# Altium schematic sheet [1]PowerSupply.SchDoc
size A4; SheetNumber: 1; SheetTotal: 3
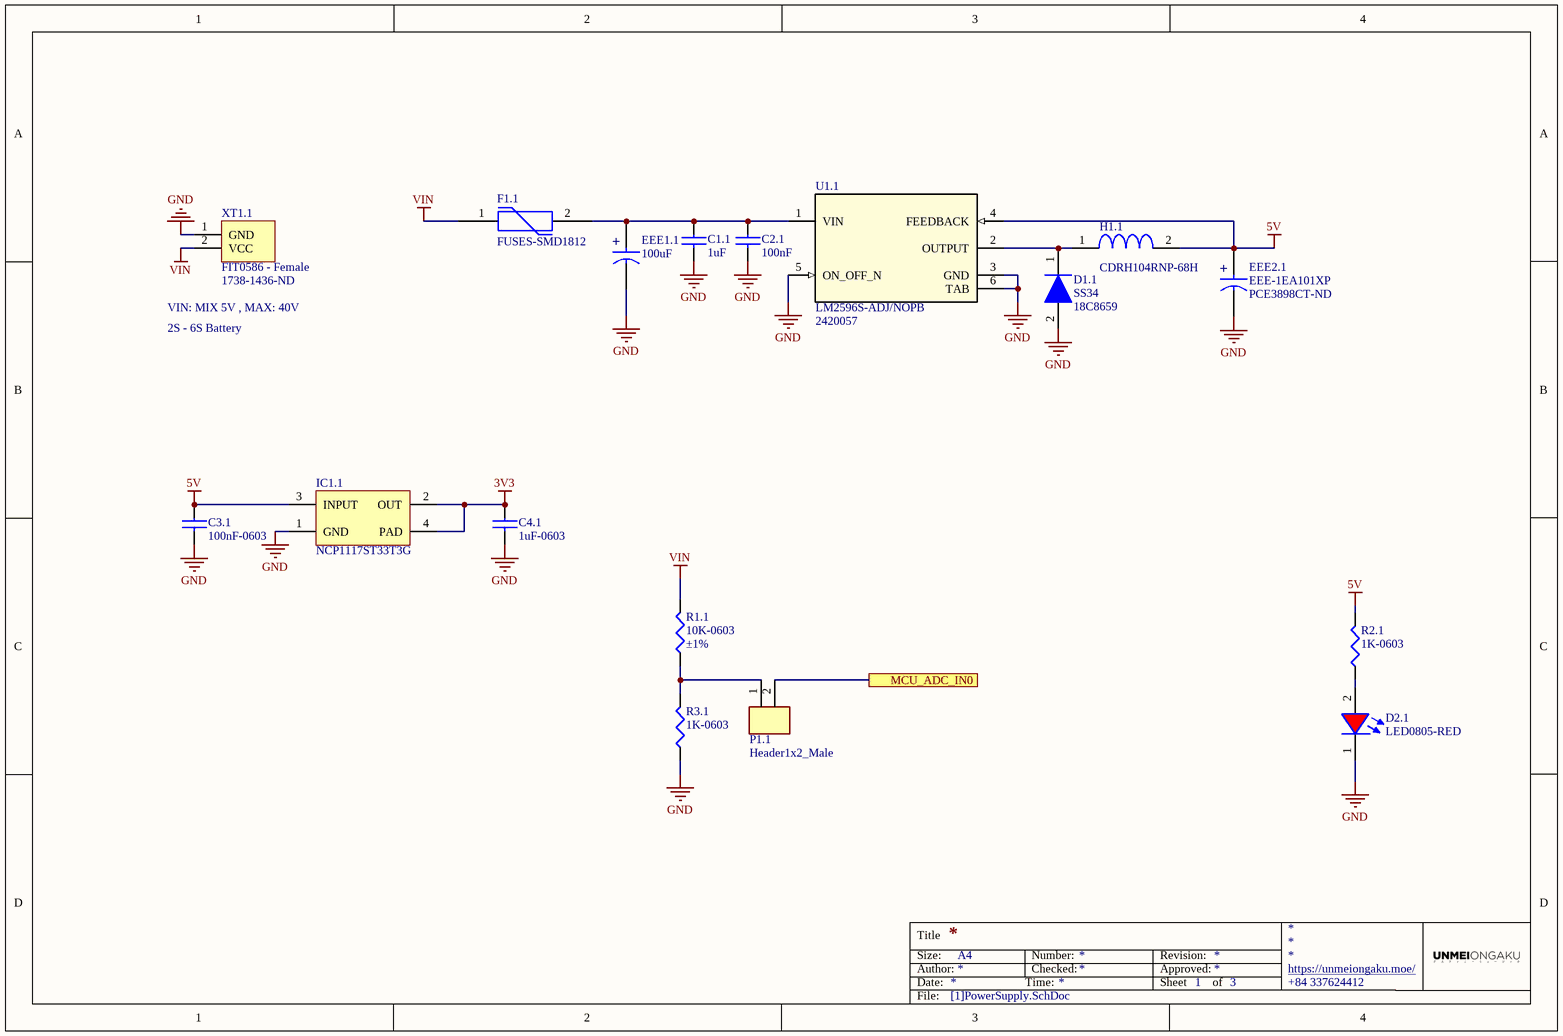
[diagram p0: [1]PowerSupply.SchDoc]

## Parts
C1.1  1uF  [CAP0603]
C2.1  100nF  [CAP0603]
C3.1  100nF-0603  [CAP0603]
C4.1  1uF-0603  [CAP0603]
D1.1  SS34  Supplier Part Number 1: 18C8659  [SS34 - 1N5822 / DO-214AA, SMA]
D2.1  LED0805-RED  [LED0805-RED]
EEE1.1  100uF  [CAPACITOR/ALU - SIZE D/SMD - 6.3X5.4]
EEE2.1  EEE-1EA101XP  Supplier Part Number 1: PCE3898CT-ND  [CAPACITOR/ALU - SIZE D8/SMD - 6.3X7.7]
F1.1  FUSES-SMD1812  [FUSES - SMD1812]
H1.1  CDRH104RNP-68H  [CDRH104RNP]
IC1.1  NCP1117ST33T3G  [SOT223-4M_AMS1117_3V3]
P1.1  Header1x2_Male  [HDR1x2_2.54_MALE]
R1.1  10K-0603  Tolerance: ±1%  [RES0603 - 3D]
R2.1  1K-0603  [RES0603 - 3D]
R3.1  1K-0603  [RES0603 - 3D]
U1.1  LM2596S-ADJ/NOPB  Supplier Part Number 1: 2420057  [TO265-5]
XT1.1  FIT0586 - Female  Supplier Part Number 1: 1738-1436-ND  [XT30U-M]

## Ports
MCU_ADC_IN0

## Nets
3V3: C4.1.1 IC1.1.2(OUT) IC1.1.4(PAD)
5V: C3.1.1 EEE2.1.1 H1.1.2 IC1.1.3(INPUT) R2.1.2 U1.1.4(FEEDBACK)
GND: C1.1.2 C2.1.2 C3.1.2 C4.1.2 D1.1.2 D2.1.1(+) EEE1.1.2 EEE2.1.2 IC1.1.1(GND) R3.1.1 U1.1.3(GND) U1.1.5(ON_OFF_N) U1.1.6(TAB) XT1.1.1(GND)
VIN: F1.1.1 R1.1.2 XT1.1.2(VCC)
MCU_ADC_IN0: P1.1.2 ; port MCU_ADC_IN0
NetC1.1_1: C1.1.1 C2.1.1 EEE1.1.1 F1.1.2 U1.1.1(VIN)
NetD1.1_1: D1.1.1 H1.1.1 U1.1.2(OUTPUT)
NetD2.1_2: D2.1.2(+) R2.1.1
NetP1.1_1: P1.1.1 R1.1.1 R3.1.2

## Notes on the sheet
- VIN: MIX 5V , MAX: 40V
- 2S - 6S Battery
- Title
- Size:
- Date:
- Author:
- A4
- Time:
- Number:
- Checked:
- Revision:
- Sheet
- Approved:
- of
- https://unmeiongaku.moe/
- +84 337624412
- File:
- (in symbol EEE-1AA101SP) +
- (in symbol EEE-1EA101XP) +

## Library data of the parts
C1.1 C4.1 = CC0603KRX7R7BB105: CAP CER 1UF 16V X7R 0603; Manufacturer 1: Yageo; Category 1: Capacitors; Capacitance: 1µF; Tolerance: ±10%; Supplier 1: Digi-Key; Supplier Part Number 1: 311-1446-1-ND; Manufacturer Part Number 1: CC0603KRX7R7BB105; RoHS 1: RoHS Compliant; Description 1: CAP CER 1UF 16V X7R 0603; Stock 1: 274580; Pricing 1: 1=0.1, 10=0.051, 100=0.0227, 500=0.0162, 1000=0.01274 (USD); Packaging: Cut Tape (CT); Part Status: Active; Voltage - Rated: 16V; Temperature Coefficient: X7R; Operating Temperature: -55°C ~ 125°C; Features: -; Ratings: -; Applications: General Purpose; Failure Rate: -; Mounting Type: Surface Mount, MLCC; Package / Case: 0603 (1608 Metric); Size / Dimension: 0.063" L x 0.031" W (1.60mm x 0.80mm); Height - Seated (Max): -; Thickness (Max): 0.035" (0.90mm); Lead Spacing: -; Lead Style: -; ComponentLink1URL: http://www.yageo.com/documents/recent/UPY-GPHC_X7R_6.3V-to-50V_18.pdf; ComponentLink1Description: http://www.yageo.com/documents/recent/UPY-GPHC_X7R_6.3V-to-50V_18.pdf; Value: 1uF
C2.1 = CC0603KRX7R9BB104: CAP CER 0.1UF 50V X7R 0603; Manufacturer 1: Yageo; Category 1: Capacitors; Capacitance: 0.1µF; Tolerance: ±10%; Supplier 1: Digi-Key; Supplier Part Number 1: 311-1344-1-ND; Manufacturer Part Number 1: CC0603KRX7R9BB104; RoHS 1: RoHS Compliant; Description 1: CAP CER 0.1UF 50V X7R 0603; Stock 1: 4411645; Pricing 1: 1=0.1, 10=0.031, 100=0.014, 500=0.00998, 1000=0.00783 (USD); Packaging: Cut Tape (CT); Part Status: Active; Voltage - Rated: 50V; Temperature Coefficient: X7R; Operating Temperature: -55°C ~ 125°C; Features: -; Ratings: -; Applications: General Purpose; Failure Rate: -; Mounting Type: Surface Mount, MLCC; Package / Case: 0603 (1608 Metric); Size / Dimension: 0.063" L x 0.031" W (1.60mm x 0.80mm); Height - Seated (Max): -; Thickness (Max): 0.035" (0.90mm); Lead Spacing: -; Lead Style: -; ComponentLink1URL: http://www.yageo.com/documents/recent/UPY-GPHC_X7R_6.3V-to-50V_18.pdf; ComponentLink1Description: http://www.yageo.com/documents/recent/UPY-GPHC_X7R_6.3V-to-50V_18.pdf; Value: 100nF
C3.1 = CC0603KRX7R9BB104: CAP CER 0.1UF 50V X7R 0603; Manufacturer 1: Yageo; Category 1: Capacitors; Capacitance: 0.1µF; Tolerance: ±10%; Value: 100nF; Supplier 1: Digi-Key; Supplier Part Number 1: 311-1344-1-ND; Manufacturer Part Number 1: CC0603KRX7R9BB104; RoHS 1: RoHS Compliant; Description 1: CAP CER 0.1UF 50V X7R 0603; Stock 1: 4411645; Pricing 1: 1=0.1, 10=0.031, 100=0.014, 500=0.00998, 1000=0.00783 (USD); Packaging: Cut Tape (CT); Part Status: Active; Voltage - Rated: 50V; Temperature Coefficient: X7R; Operating Temperature: -55°C ~ 125°C; Features: -; Ratings: -; Applications: General Purpose; Failure Rate: -; Mounting Type: Surface Mount, MLCC; Package / Case: 0603 (1608 Metric); Size / Dimension: 0.063" L x 0.031" W (1.60mm x 0.80mm); Height - Seated (Max): -; Thickness (Max): 0.035" (0.90mm); Lead Spacing: -; Lead Style: -; ComponentLink1URL: http://www.yageo.com/documents/recent/UPY-GPHC_X7R_6.3V-to-50V_18.pdf; ComponentLink1Description: http://www.yageo.com/documents/recent/UPY-GPHC_X7R_6.3V-to-50V_18.pdf
D1.1 = SS34: SS Series 500 mV 3 A 40 V Max Reverse Voltage Schottky Rectifier - DO-214AB; Manufacturer: ON Semiconductor / Fairchild; Number of Terminals/Pins: 2; Package Body Material: Plastic; Diode Element Material: SILICON; Forward Current: 3A; Element Configuration: Single; Max Repetitive Reverse Voltage (Vrrm): 40V; Forward Voltage: 500mV; Max Forward Surge Current (Ifsm): 100A; Polarity: Standard; Max Reverse Current: 500uA; Number of Elements: 1; Max Power Dissipation: 2.27W; Supplier 1: Newark; Manufacturer Part Number: SS34; RoHS: Yes; Category: Schottky Diodes; Stock 1: 7040; Pricing 1: 1=0.65000, 25=0.57600, 50=0.50900, 100=0.44100, 250=0.39500, 500=0.34900, 1000=0.27900 (USD); Mount: Surface Mount; Case/Package: SMC; Number of Pins: 2; Contact Plating: Tin,Matte; Package Shape: Rectangular; Terminal Finish: Tin; Min Operating Temperature: -55°C; Max Operating Temperature: 150°C; Packaging: Tape and Reel; Voltage Rating (DC): 40V; Current Rating: 3A; Output Current: 3A; Max Surge Current: 100A; Package Quantity: 1; Max Reverse Leakage Current: 500uA; Peak Non-Repetitive Surge Current: 100A; Current: 3A; Voltage: 40V; Average Rectified Current: 3A; Max Reverse Voltage (DC): 40V; Series: -; Moisture Sensitivity Level: 1; JESD-30 Code: R-PDSO-C2; Peak Reflow Temperature (Cel): 260°C; Surface Mount: Yes; Terminal Position: DUAL; Technology: SCHOTTKY; Number of Phases: 1; Terminal Form: C BEND; Length: 7.15mm; Width: 6.25mm; Height: 2.75mm; Radiation Hardening: No; RoHS Compliant: Yes; Reach SVHC Compliant: Yes; Lead Free: Lead Free; JEDEC-95 Code: DO-214AB
EEE1.1 = EEE-1AA101SP: Cap Aluminum 100uF 10V 20% (6.3 X 5.4mm) SMD 70mA 2000 hr 85°C T/R; Manufacturer: Panasonic; Polarity: Polar; Life (Hours): 2000Hour; Leakage Current: 3uA; Supplier 1: Digi-Key; Manufacturer Part Number: EEE-1AA101SP; RoHS: Yes; Category: Aluminum Electrolytic Capacitors; Pricing 1: 1=0.38000, 10=0.26400, 50=0.18520, 100=0.15870, 500=0.11902 (USD); Mount: Surface Mount,PCB; Case/Package: Radial; Contact Plating: Tin; Min Operating Temperature: -40°C; Max Operating Temperature: 85°C; Packaging: Tape and Reel; Capacitance: 100uF; Tolerance: 20%; Ripple Current: 70mA; Voltage Rating: 10V; Package Quantity: 1000; Voltage Rating (DC): 10V; Termination: SMD/SMT; Ripple Current (AC): 70mA; Voltage: 10V; Features: General Purpose; Series: S; Construction: Cylindrical; Diameter: 6.3mm; Length: 5.5mm; Height: 5.4mm; Height - Seated (Max): 0.213inch; Radiation Hardening: No; Lead Free: Lead Free; RoHS Compliant: Yes; REACH SVHC: Unknown; ComponentLink1URL: https://datasheet.ciiva.com/43470/aba0000ce2-43470621.pdf?src-supplier=Farnell; ComponentLink1Description: https://datasheet.ciiva.com/43470/aba0000ce2-43470621.pdf?src-supplier=Farnell; ComponentLink2URL: https://datasheet.ciiva.com/46378/aba0000ce2-46378266.pdf?src-supplier=Element14; ComponentLink2Description: https://datasheet.ciiva.com/46378/aba0000ce2-46378266.pdf?src-supplier=Element14; ComponentLink3URL: https://datasheet.ciiva.com/31414/aba0000ce2-31414629.pdf?src-supplier=Farnell; ComponentLink3Description: https://datasheet.ciiva.com/31414/aba0000ce2-31414629.pdf?src-supplier=Farnell; ComponentLink4URL: https://datasheet.ciiva.com/46374/aba0000ce2-46374349.pdf?src-supplier=Element14; ComponentLink4Description: https://datasheet.ciiva.com/46374/aba0000ce2-46374349.pdf?src-supplier=Element14; ComponentLink5URL: https://datasheet.ciiva.com/14598/70255710-14598444.pdf?src-supplier=Allied+Electronics; ComponentLink5Description: https://datasheet.ciiva.com/14598/70255710-14598444.pdf?src-supplier=Allied+Electronics; ComponentLink6URL: https://datasheet.ciiva.com/14604/70255710-14604862.pdf?src-supplier=Allied+Electronics; ComponentLink6Description: https://datasheet.ciiva.com/14604/70255710-14604862.pdf?src-supplier=Allied+Electronics; ComponentLink7URL: https://datasheet.ciiva.com/2983/aba0000ce2-2983905.pdf?src-supplier=Avnet; ComponentLink7Description: https://datasheet.ciiva.com/2983/aba0000ce2-2983905.pdf?src-supplier=Avnet; ComponentLink8URL: https://datasheet.ciiva.com/15166/getdatasheetpartid-178534-15166250.pdf?src-supplier=Verical; ComponentLink8Description: https://datasheet.ciiva.com/15166/getdatasheetpartid-178534-15166250.pdf?src-supplier=Verical; ComponentLink9URL: https://datasheet.ciiva.com/2985/aba0000ce2-2985040.pdf?src-supplier=Avnet; ComponentLink9Description: https://datasheet.ciiva.com/2985/aba0000ce2-2985040.pdf?src-supplier=Avnet; ComponentLink10URL: https://datasheet.ciiva.com/30099/11aba0000ce2-30099766.pdf?src-supplier=Onlinecomponents.com; ComponentLink10Description: https://datasheet.ciiva.com/30099/11aba0000ce2-30099766.pdf?src-supplier=Onlinecomponents.com; ComponentLink11URL: https://datasheet.ciiva.com/17536/aba0000ce2-17536070.pdf?src-supplier=Avnet+Europe; ComponentLink11Description: https://datasheet.ciiva.com/17536/aba0000ce2-17536070.pdf?src-supplier=Avnet+Europe; Supplier Part Number 1: PCE3866DKR-ND
EEE2.1 = EEE-1EA101XP: Cap Aluminum 100uF 25V 20% (6.3 X 7.7mm) SMD 143mA 2000h 85°C T/R; Manufacturer: Panasonic; Polarity: Polar; Life (Hours): 2000Hour; Leakage Current: 3uA; Supplier 1: Digi-Key; Manufacturer Part Number: EEE-1EA101XP; RoHS: Yes; Category: Aluminum Electrolytic Capacitors; Pricing 1: 1=0.52000, 10=0.36100, 50=0.25240, 100=0.21630 (USD); Mount: Surface Mount,PCB; Case/Package: Radial; Contact Plating: Tin; Min Operating Temperature: -40°C; Max Operating Temperature: 85°C; Capacitance: 100uF; Tolerance: 20%; Voltage Rating (DC): 25V; Ripple Current: 143mA; Packaging: Tape and Reel; Voltage Rating: 25V; Package Quantity: 900; Termination: SMD/SMT; Ripple Current (AC): 143mA; Voltage: 25V; Series: S; Construction: Cylindrical; Diameter: 6.3mm; Length: 8mm; Height: 7.7mm; Height - Seated (Max): 0.303inch; Radiation Hardening: No; Lead Free: Lead Free; RoHS Compliant: Yes; REACH SVHC: Unknown; ComponentLink1URL: https://datasheet.ciiva.com/24022/aba0000ce2-40801-24022875.pdf?src-supplier=Mouser; ComponentLink1Description: https://datasheet.ciiva.com/24022/aba0000ce2-40801-24022875.pdf?src-supplier=Mouser; ComponentLink2URL: https://datasheet.ciiva.com/16201/aba0000ce2-16201065.pdf?src-supplier=Future+Electronics; ComponentLink2Description: https://datasheet.ciiva.com/16201/aba0000ce2-16201065.pdf?src-supplier=Future+Electronics; ComponentLink3URL: https://datasheet.ciiva.com/30108/11aba0000ce2-30108047.pdf?src-supplier=Onlinecomponents.com; ComponentLink3Description: https://datasheet.ciiva.com/30108/11aba0000ce2-30108047.pdf?src-supplier=Onlinecomponents.com; ComponentLink4URL: https://datasheet.ciiva.com/17529/aba0000ce2-17529557.pdf?src-supplier=Avnet+Europe; ComponentLink4Description: https://datasheet.ciiva.com/17529/aba0000ce2-17529557.pdf?src-supplier=Avnet+Europe
H1.1 = CDRH104RNP-680NC: Ind Power Shielded Wirewound 68uH 30% 100KHz Ferrite 1.42A Carrier T/R; Manufacturer: Sumida; Saturation Current: 1.5A; DC Resistance (DCR): 213mR; Supplier 1: Digi-Key; Manufacturer Part Number: CDRH104RNP-680NC; RoHS: Yes; Category: Fixed Inductors; Stock 1: 26557; Pricing 1: 1=1.78000, 10=1.64700, 25=1.51000, 50=1.29060, 100=1.15320, 250=0.98848, 500=0.93356 (USD); Mount: Surface Mount; Case/Package: Nonstandard; Core Material: Ferrite; Min Operating Temperature: -40°C; Max Operating Temperature: 100°C; Package Quantity: 1000; Current Rating: 1.42A; Tolerance: 30%; Shielding: Shielded; Packaging: Tape and Reel; Inductance: 68uH; Test Frequency: 100kHz; Max DC Current: 1.42A; Termination: SMD/SMT; Series: CDRH; Rated Current-Max: 1.5A; Length: 0.402inch; Width: 0.405inch; Height: 4mm; Height - Seated (Max): 0.157inch; Depth: 10.3mm; Radiation Hardening: No; Lead Free: Lead Free; RoHS Compliant: Yes; ComponentLink1URL: http://www.sumida.com/products/pdf/CDRH104,104R.pdf?src-supplier=Digi-Key; ComponentLink1Description: http://www.sumida.com/products/pdf/CDRH104,104R.pdf?src-supplier=Digi-Key; ComponentLink2URL: http://products.sumida.com/products/pdf/CDRH104R.pdf?src-supplier=Digi-Key; ComponentLink2Description: http://products.sumida.com/products/pdf/CDRH104R.pdf?src-supplier=Digi-Key; ComponentLink3URL: http://www.sumida.com/products/pdf/CDRH104,104R.pdf?src-supplier=Mouser; ComponentLink3Description: http://www.sumida.com/products/pdf/CDRH104,104R.pdf?src-supplier=Mouser; ComponentLink4URL: http://www.sumida.com/products/pdf/CDRH104R.pdf?src-supplier=Avnet; ComponentLink4Description: http://www.sumida.com/products/pdf/CDRH104R.pdf?src-supplier=Avnet; ComponentLink5URL: http://www.sumida.com/products/pdf/CDRH104,104R.pdf?src-supplier=Future+Electronics; ComponentLink5Description: http://www.sumida.com/products/pdf/CDRH104,104R.pdf?src-supplier=Future+Electronics; Supplier Part Number 1: 308-2170-1-ND
IC1.1 = AMS1117 - 3V3: LDO Voltage Regulators 3.3V 1A Positive; Manufacturer: ON Semiconductor; Input Voltage MAX: 20 V; Number of Outputs: 1 Output; Output Type: Fixed; Quiescent Current: 10 mA; Dropout Voltage - Max: 1.1 V at 100 mA; Voltage Regulation Accuracy: 1 %; Dropout Voltage: 0.95 V at 100 mA; Ib - Input Bias Current: 6 mA; Line Regulation: 0.8 mV; Load Regulation: 4.3 mV; Supplier 1: Mouser; Manufacturer Part Number: NCP1117ST33T3G; RoHS: RoHS Compliant; Category: LDO Voltage Regulators; Stock 1: 0; Pricing 1: 1=0.450, 10=0.366, 100=0.223, 1000=0.173, 4000=0.147, 8000=0.137, 24000=0.130, 48000=0.127 (USD); Height: 1.69 mm (Max); Length: 6.7 mm (Max); Output Current: 1 A; Output Voltage: 3.3 V; Package / Case: SOT-223-3; Packaging: Cut Tape; Series: NCP1117; Width: 3.7 mm (Max); Brand: ON Semiconductor; Mounting Style: SMD/SMT; Maximum Operating Temperature: + 125 C; Minimum Operating Temperature: 0 C; Polarity: Positive; Standard Pack Qty: 4000; RoHS - Mouser: Y; Minimum Order Quantity: 1; Reeling: True; ComponentLink1URL: https://www.mouser.com/ds/2/308/NCP1117-D-81326.pdf; ComponentLink1Description: https://www.mouser.com/ds/2/308/NCP1117-D-81326.pdf; Supplier Part Number 1: 863-NCP1117ST33T3G
P1.1 = HDR1x2_2.54_MALE: Header1x2_2.54_MALE
R1.1 = RC0603FR-0710KL: RES SMD 10K OHM 1% 1/10W 0603; Manufacturer: Yageo; Power (Watts): 0.1W, 1/10W; Temperature Coefficient: ±100ppm/°C; Supplier 1: Digi-Key; Manufacturer Part Number: RC0603FR-0710KL; RoHS: RoHS Compliant; Category: Resistors; Stock 1: 16545228; Pricing 1: 1=0.1, 10=0.015, 100=0.006, 1000=0.00268, 2500=0.00233 (USD); Packaging: Cut Tape (CT); Part Status: Active; Composition: Thick Film; Features: Moisture Resistant; Operating Temperature: -55°C ~ 155°C; Package / Case: 0603 (1608 Metric); Supplier Device Package: 0603; Size / Dimension: 0.063" L x 0.032" W (1.60mm x 0.80mm); Height - Seated (Max): 0.022" (0.55mm); Failure Rate: -; ComponentLink1URL: http://www.yageo.com/documents/recent/PYu-RC_Group_51_RoHS_L_7.pdf; ComponentLink1Description: http://www.yageo.com/documents/recent/PYu-RC_Group_51_RoHS_L_7.pdf; Supplier Part Number 1: 311-10.0KHRCT-ND; Value: 10K
R2.1 R3.1 = RC0603JR-071KL: RES SMD 1K OHM 5% 1/10W 0603; Manufacturer 1: Yageo; Category 1: Resistors; Power (Watts): 0.1W, 1/10W; Temperature Coefficient: ±100ppm/°C; Supplier 1: Digi-Key; Supplier Part Number 1: 311-1.0KGRCT-ND; Manufacturer Part Number 1: RC0603JR-071KL; RoHS 1: RoHS Compliant; Description 1: RES SMD 1K OHM 5% 1/10W 0603; Stock 1: 2853955; Pricing 1: 1=0.1, 10=0.011, 100=0.0044, 1000=0.00198, 2500=0.00172 (USD); Packaging: Cut Tape (CT); Part Status: Active; Resistance (Ohms): 1k; Tolerance: ±5%; Composition: Thick Film; Features: Moisture Resistant; Operating Temperature: -55°C ~ 155°C; Package / Case: 0603 (1608 Metric); Supplier Device Package: 0603; Size / Dimension: 0.063" L x 0.031" W (1.60mm x 0.80mm); Height - Seated (Max): 0.022" (0.55mm); Failure Rate: -; ComponentLink1URL: http://www.yageo.com/documents/recent/PYu-RC_Group_51_RoHS_L_7.pdf; ComponentLink1Description: http://www.yageo.com/documents/recent/PYu-RC_Group_51_RoHS_L_7.pdf; Value: 1K
U1.1 = LM2596S-ADJ/NOPB: Optoisolator 5KV Trans 4SMD / Optocoupler Dc-in 1-CH Transistor Dc-out 4-PIN PDIP SMD; Mfr_Name: Texas Instruments; PartNumber: LM2596SX-ADJ/NOPB; Manufacturer Part Number: PC817XNNIP0F; CompType: IC; Reverse Breakdown Voltage: 6V; Forward Voltage: 1.4V; Forward Current: 50mA; Rise Time: 18000ns; Collector Emitter Voltage (VCEO): 80V; Collector Emitter Saturation Voltage: 200mV; Number of Elements: 1; Power Dissipation: 200mW; Input Type: DC; Output Current per Channel: 30mA; Type: DEV; RefDes: RefDes; Copyright: Copyright (C) 2021 Ultra Librarian. All rights reserved.; Manufacturer_Part_Number: LM2596S-ADJ/NOPB; Alternate_PartNumber: LM2596S-ADJ/NOPB; PackageReference: KTT0005B; MountType: SMT; RoHS: Y; Manufacturer: Texas Instruments; Supplier 1: Farnell; Category: Optocouplers; Pricing 1: 1=0.31700, 25=0.29900, 100=0.21300, 250=0.17700, 500=0.14100, 2000=0.13800 (GBP); Mount: Surface Mount; Case/Package: SMD/SMT; Number of Pins: 4; Contact Plating: Copper,Tin; Min Operating Temperature: -30°C; Max Operating Temperature: 100°C; Fall Time: 18000ns; Packaging: Tape and Reel; Max Power Dissipation: 200mW; Package Quantity: 2000; Number of Channels: 1; Output Voltage: 80V; Max Input Current: 50mA; Max Collector Current: 50mA; Isolation Voltage: 5kV; Input Current: 50mA; Collector-emitter Voltage-Max: 200mV; Max Output Voltage: 80V; Isolation Voltage-Max: 5kV; Radiation Hardening: No; RoHS Compliant: Yes; Lead Free: Lead Free; ComponentLink1URL: https://datasheet.ciiva.com/15119/getdatasheetpartid-299374-15119023.pdf?src-supplier=Verical; ComponentLink1Description: https://datasheet.ciiva.com/15119/getdatasheetpartid-299374-15119023.pdf?src-supplier=Verical; ComponentLink2URL: https://datasheet.ciiva.com/2086/pc817xxnip0f-series-2086508.pdf?src-supplier=Digi-Key; ComponentLink2Description: https://datasheet.ciiva.com/2086/pc817xxnip0f-series-2086508.pdf?src-supplier=Digi-Key; ComponentLink3URL: https://datasheet.ciiva.com/2086/pc817xxnip0f-series-2086507.pdf?src-supplier=Digi-Key; ComponentLink3Description: https://datasheet.ciiva.com/2086/pc817xxnip0f-series-2086507.pdf?src-supplier=Digi-Key; ComponentLink4URL: https://datasheet.ciiva.com/2086/pc817xxnip0f-series-2086509.pdf?src-supplier=Digi-Key; ComponentLink4Description: https://datasheet.ciiva.com/2086/pc817xxnip0f-series-2086509.pdf?src-supplier=Digi-Key; ComponentLink5URL: https://datasheet.ciiva.com/46396/1812378-46396954.pdf?src-supplier=Element14; ComponentLink5Description: https://datasheet.ciiva.com/46396/1812378-46396954.pdf?src-supplier=Element14; ComponentLink6URL: https://datasheet.ciiva.com/46435/1812378-46435723.pdf?src-supplier=Element14; ComponentLink6Description: https://datasheet.ciiva.com/46435/1812378-46435723.pdf?src-supplier=Element14; ComponentLink7URL: https://datasheet.ciiva.com/16475/pc817xnnip0f-16475911.pdf?src-supplier=Future+Electronics; ComponentLink7Description: https://datasheet.ciiva.com/16475/pc817xnnip0f-16475911.pdf?src-supplier=Future+Electronics
XT1.1 = FIT0586 - Female: High Quality Gold Plated Male and Female Bullet Connector; Manufacturer: DFRobot; Supplier 1: Digikey; Manufacturer Part Number: FIT0586; RoHS: No; Category: Uncategorized; Stock 1: 818; Pricing 1: 1=1.9 (USD); ComponentLink1URL: https://media.digikey.com/pdf/Data%20Sheets/DFRobot%20PDFs/FIT0586_Web.pdf?src-supplier=Digikey; ComponentLink1Description: https://media.digikey.com/pdf/Data%20Sheets/DFRobot%20PDFs/FIT0586_Web.pdf?src-supplier=Digikey